# Altium schematic sheet inout.SchDoc
size A4
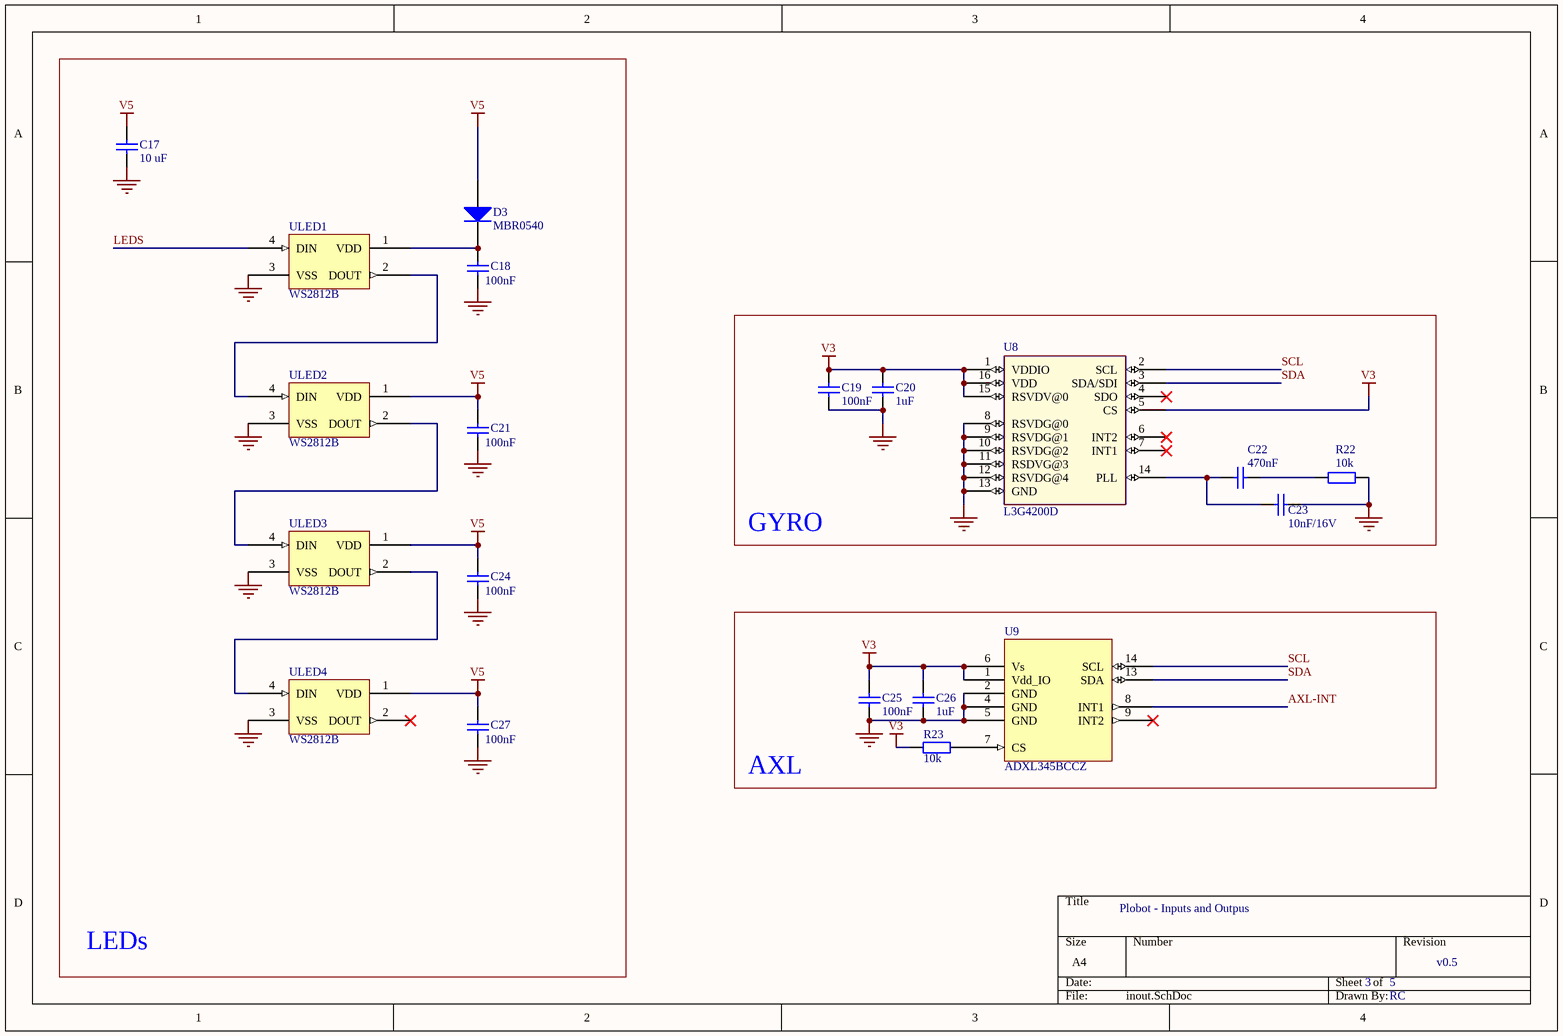
[diagram p0: inout.SchDoc]

## Parts
C17  10 uF  [CAPC3216N]
C18  100nF  [CAPC1608N]
C19  100nF  [CAPC1608N]
C20  1uF  [CAPC2012N]
C21  100nF  [CAPC1608N]
C22  470nF  [CAPC2012N]
C23  10nF/16V  [CAPC2012N]
C24  100nF  [CAPC1608N]
C25  100nF  [CAPC1608N]
C26  1uF  [CAPC2012N]
C27  100nF  [CAPC1608N]
D3  MBR0540  [SOD123/X.85]
R22  10k  [RESC1608N]
R23  10k  [RESC1608N]
U8  L3G4200D  [LGA16-4X4]
U9  ADXL345BCCZ  [ADXL345]
ULED1  WS2812B  [WS2812B]
ULED2  WS2812B  [WS2812B]
ULED3  WS2812B  [WS2812B]
ULED4  WS2812B  [WS2812B]

## Blocks framed on the sheet
LEDs: C17 C18 C21 C24 C27 D3 ULED1-ULED4
GYRO: C19 C20 C22 C23 R22 U8
AXL: C25 C26 R23 U9

## Nets
GND: C17.2 C18.2 C19.2 C20.2 C21.2 C23.2 C24.2 C25.2 C26.2 C27.2 R22.2 U8.8(RSVDG@0) U8.9(RSVDG@1) U8.10(RSVDG@2) U8.11(RSDVG@3) U8.12(RSVDG@4) U8.13(GND) U9.2(GND) U9.4(GND) U9.5(GND) ULED1.3(VSS) ULED2.3(VSS) ULED3.3(VSS) ULED4.3(VSS)
V3: C19.1 C20.1 C25.1 C26.1 R23.1 U8.1(VDDIO) U8.5(CS) U8.15(RSVDV@0) U8.16(VDD) U9.1(Vdd_IO) U9.6(Vs)
V5: C17.1 C21.1 C24.1 C27.1 D3.2(A) ULED2.1(VDD) ULED3.1(VDD) ULED4.1(VDD)
AXL-INT: U9.8(INT1)
LEDS: ULED1.4(DIN)
SCL: U8.2(SCL) U9.14(SCL)
SDA: U8.3(SDA/SDI) U9.13(SDA)
NetC18_1: C18.1 D3.1(K) ULED1.1(VDD)
NetC22_1: C22.1 C23.1 U8.14(PLL)
NetC22_2: C22.2 R22.1
NetR23_2: R23.2 U9.7(CS)
NetULED1_2: ULED1.2(DOUT) ULED2.4(DIN)
NetULED2_2: ULED2.2(DOUT) ULED3.4(DIN)
NetULED3_2: ULED3.2(DOUT) ULED4.4(DIN)

Not connected (* = marked no-connect by the designer): U8 4(SDO)* 6(INT2)* 7(INT1)*; U9 9(INT2)*; ULED4 2(DOUT)*

## Notes on the sheet
- Plobot - Inputs and Outpus
- 3
- 5
- v0.5
- RC

## Library data of the parts
C17 C20 C22 C23 C26 = Cap_2: Capacitor; PackageReference: RAD-0.3
  C17: Published: 8-Jun-2000; LatestRevisionDate: 17-Jul-2002; LatestRevisionNote: Re-released for DXP Platform.; Publisher: Altium Limited; PackageDescription: Radial Cap, Thru-Hole; 2 Leads; 0.3 in Pin Spacing; Value: 10 uF
  C20: Value: 1uF; ComponentLink3Description: DIGIKEY
  C22: Value: 470nF; ComponentLink3Description: DIGIKEY
  C23: Value: 10nF/16V; ComponentLink3Description: DIGIKEY
  C26: Published: 8-Jun-2000; LatestRevisionDate: 17-Jul-2002; LatestRevisionNote: Re-released for DXP Platform.; Publisher: Altium Limited; Value: 1uF; PackageDescription: Radial Cap, Thru-Hole; 2 Leads; 0.3 in Pin Spacing
C18 C19 C21 C24 C25 C27 = Cap: Capacitor; PackageReference: RAD-0.3; Value: 100nF
  C18 C21 C24 C25 C27: Published: 8-Jun-2000; LatestRevisionDate: 17-Jul-2002; LatestRevisionNote: Re-released for DXP Platform.; Publisher: Altium Limited; PackageDescription: Radial Cap, Thru-Hole; 2 Leads; 0.3 in Pin Spacing
  C19: ComponentLink3Description: DIGIKEY
D3 = Diode: Default Diode; Published: 8-Jun-2000; LatestRevisionDate: 17-Jul-2002; LatestRevisionNote: Re-released for DXP Platform.; PackageVersion: Sep-1996; PackageReference: SMC; Publisher: Altium Limited; Code_JEDEC: DO-214-AB
R22 R23 = Res2: Resistor; PackageReference: AXIAL-0.4; Value: 10k
  R22: ComponentLink3Description: DIGIKEY
  R23: Published: 8-Jun-2000; LatestRevisionDate: 17-Jul-2002; LatestRevisionNote: Re-released for DXP Platform.; Publisher: Altium Limited
U8 = L3G4200D: L3G4200D Series 2.4 - 3.6 V Three-axis Angular Rate MEMS Motion Sensor - LGA-16; Price: 1.5 USD; Value: *; ComponentLink3Description: DIGIKEY; ComponentLink3URL: http://www.digikey.com/product-detail/en/stmicroelectronics/L3G4200DTR/497-11071-6-ND/2587913
U9 = ADXL345